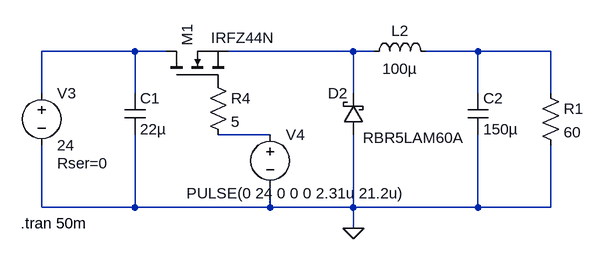
[diagram p0: schematic simulation.asc]
simulation.asc, the LTspice schematic file:
Version 4
SHEET 1 1096 680
WIRE -928 16 -1072 16
WIRE -880 16 -928 16
WIRE -592 16 -784 16
WIRE -560 16 -592 16
WIRE -400 16 -480 16
WIRE -288 16 -400 16
WIRE -1072 80 -1072 16
WIRE -928 80 -928 16
WIRE -592 80 -592 16
WIRE -400 80 -400 16
WIRE -288 80 -288 16
WIRE -720 144 -800 144
WIRE -1072 256 -1072 160
WIRE -928 256 -928 144
WIRE -928 256 -1072 256
WIRE -720 256 -720 224
WIRE -720 256 -928 256
WIRE -592 256 -592 144
WIRE -592 256 -720 256
WIRE -400 256 -400 144
WIRE -400 256 -592 256
WIRE -288 256 -288 160
WIRE -288 256 -400 256
WIRE -592 288 -592 256
FLAG -592 288 0
SYMBOL voltage -1072 64 R0
WINDOW 123 0 0 Left 0
WINDOW 39 24 124 Left 2
SYMATTR SpiceLine Rser=0
SYMATTR InstName V3
SYMATTR Value 24
SYMBOL ind -576 32 R270
WINDOW 0 32 56 VTop 2
WINDOW 3 5 56 VBottom 2
SYMATTR InstName L2
SYMATTR Value 100µ
SYMBOL cap -416 80 R0
SYMATTR InstName C2
SYMATTR Value 150µ
SYMATTR SpiceLine V=6.3 Irms=0 Rser=0 Lser=0 mfg="Murata" pn="GRM31CR60J157ME11" type="X5R"
SYMBOL schottky -576 144 R180
WINDOW 0 24 64 Left 2
WINDOW 3 -155 -5 Left 2
SYMATTR InstName D2
SYMATTR Value RBR5LAM60A
SYMATTR Description Diode
SYMATTR Type diode
SYMBOL voltage -720 128 R0
WINDOW 123 0 0 Left 0
WINDOW 39 0 0 Left 0
WINDOW 3 -129 106 Left 2
SYMATTR InstName V4
SYMATTR Value PULSE(0 24 0 0 0 2.31u 21.2u)
SYMBOL res -816 48 R0
SYMATTR InstName R4
SYMATTR Value 5
SYMBOL nmos -880 64 R270
WINDOW 3 69 69 VRight 2
SYMATTR Value IRFZ44N
SYMATTR InstName M1
SYMBOL cap -944 80 R0
SYMATTR InstName C1
SYMATTR Value 22µ
SYMBOL res -304 64 R0
SYMATTR InstName R1
SYMATTR Value 60
TEXT -1104 280 Left 2 !.tran 50m

The netlist it stands for:
* simulation.asc
V3 N001 0 24 Rser=0
L2 N002 N003 100µ
C2 N003 0 150µ V=6.3 Irms=0 Rser=0 Lser=0 mfg="Murata" pn="GRM31CR60J157ME11" type="X5R"
D2 0 N002 RBR5LAM60A
V4 N004 0 PULSE(0 24 0 0 0 2.31u 21.2u)
R4 P001 N004 5
M1 N001 P001 N002 N002 IRFZ44N
C1 N001 0 22µ
R1 N003 0 60
.model D D
.lib standard.dio
.model NMOS NMOS
.model PMOS PMOS
.lib standard.mos
.tran 50m
.backanno
.end